# EasyEDA Pro project Flyback.eprj

# Schematic Schematic1
Board Name: Board1; Create Date: 2025-04-12
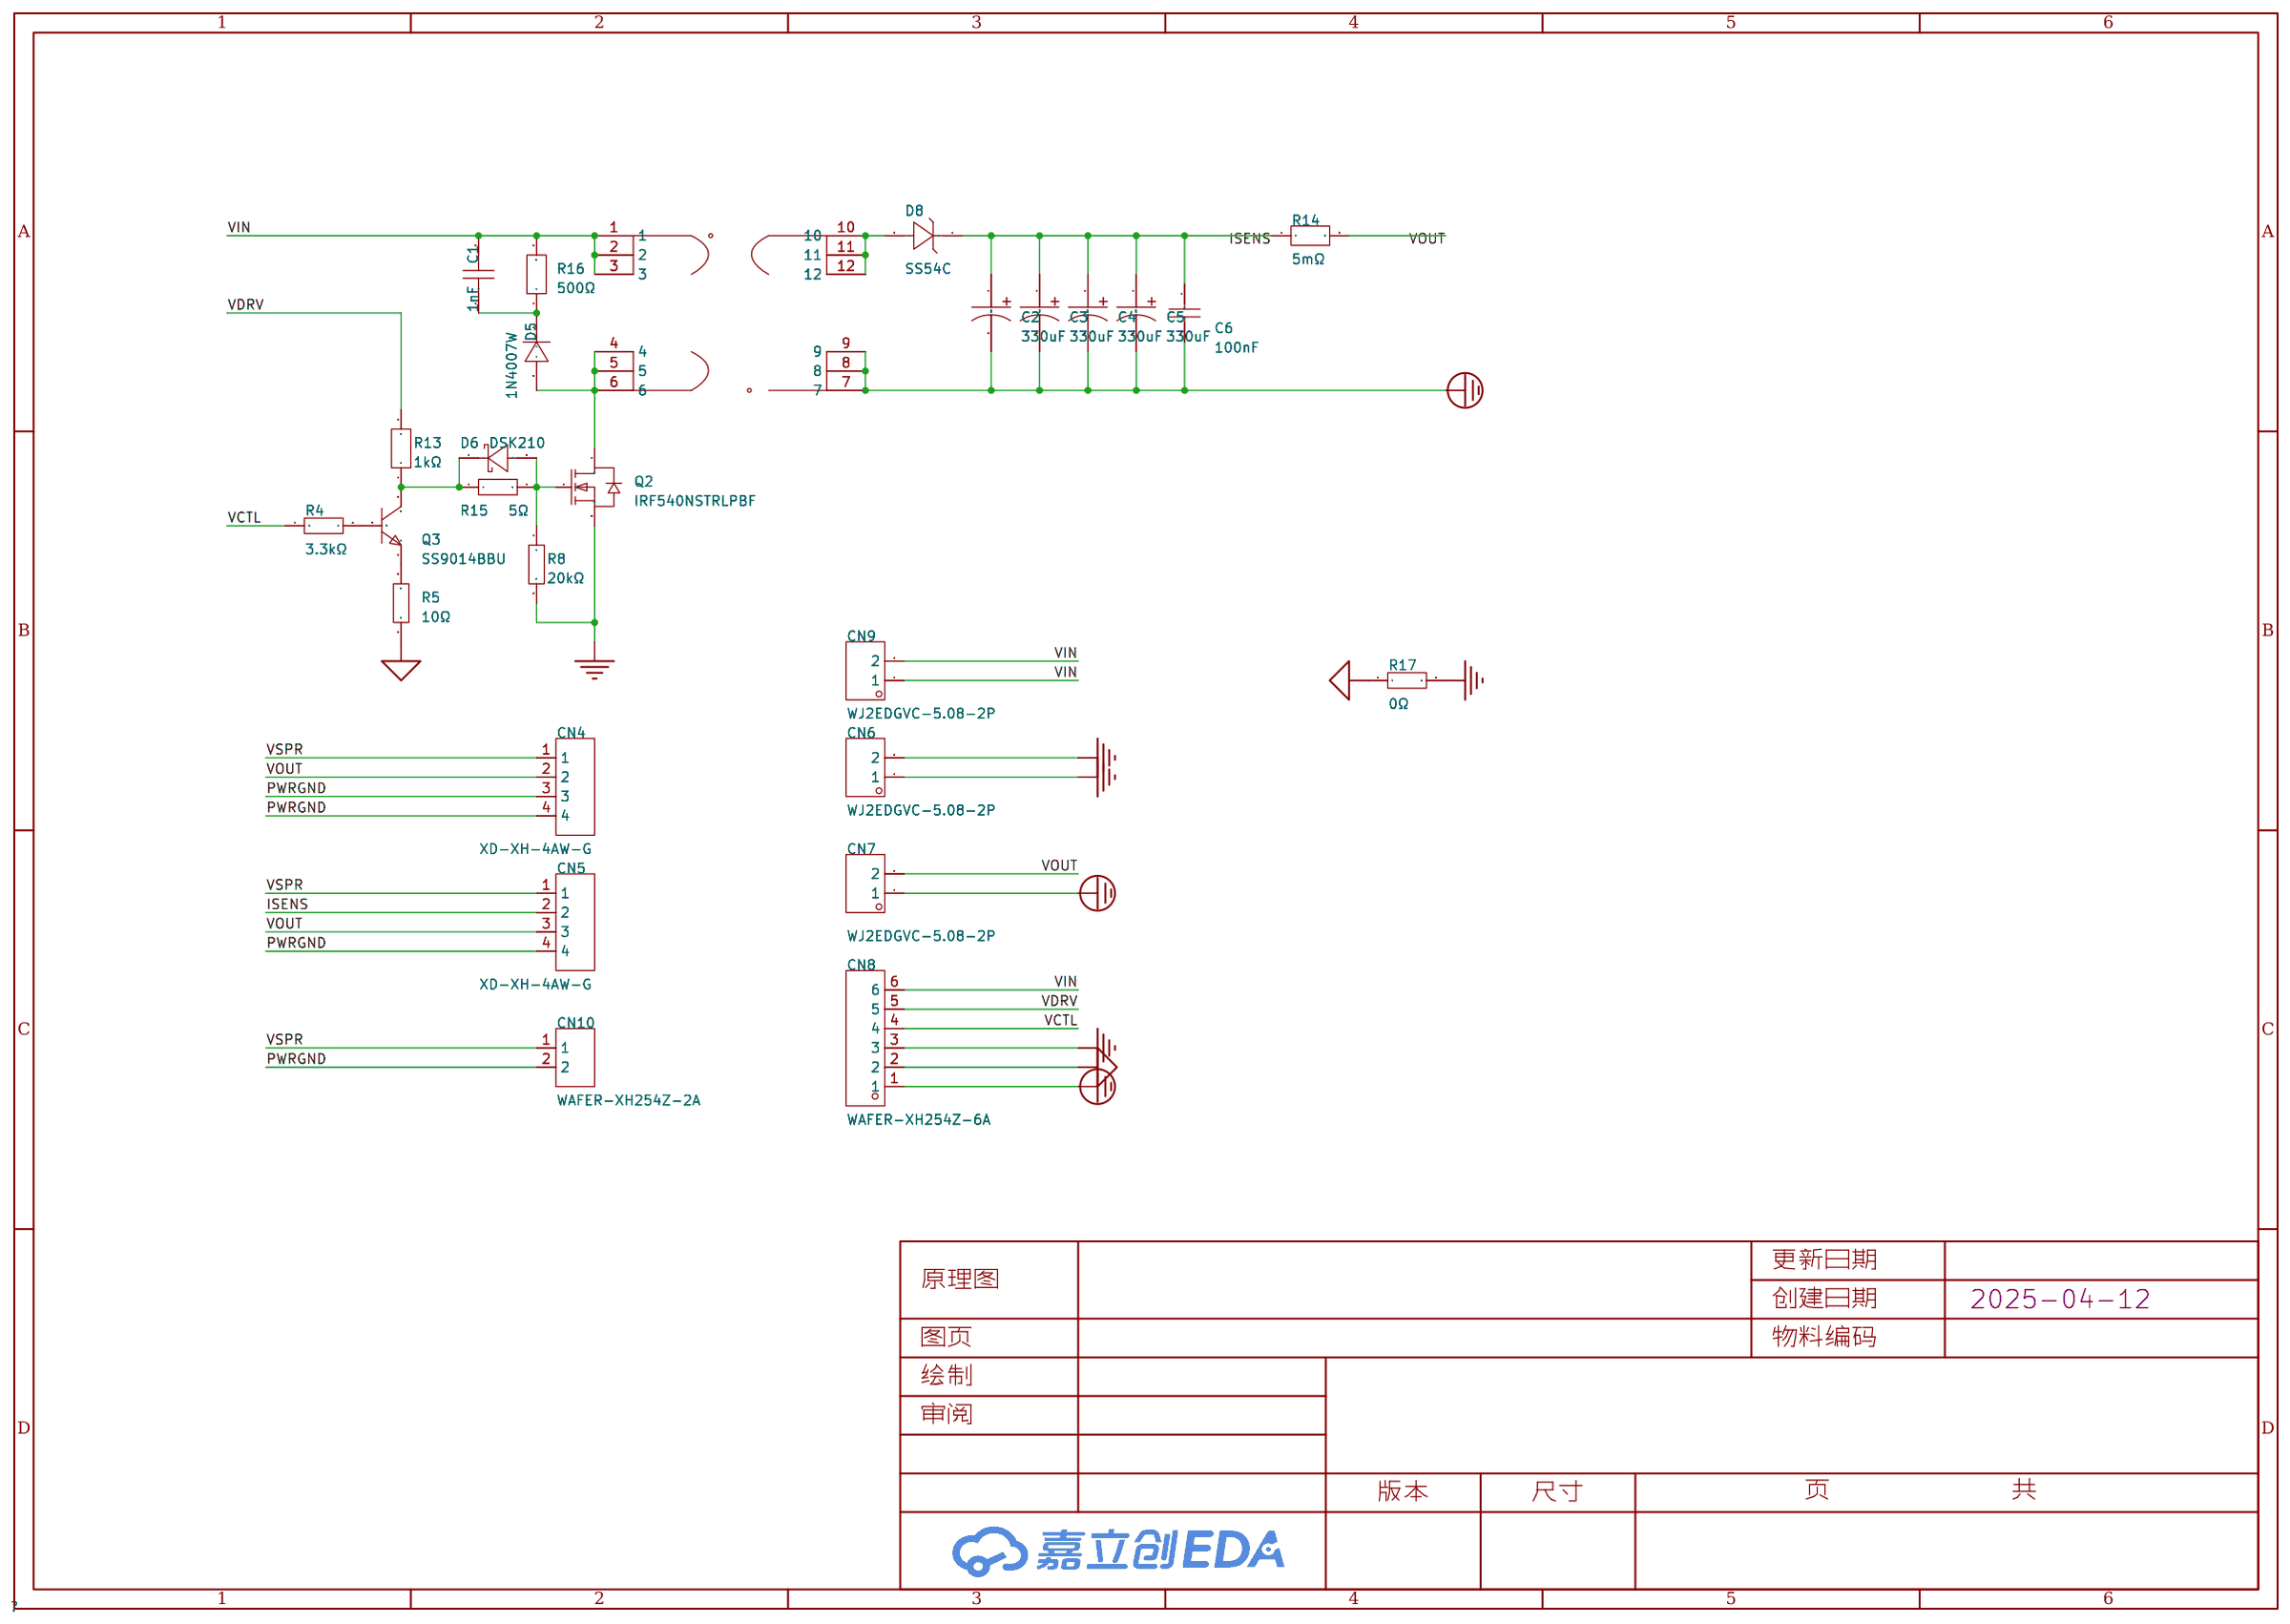
[diagram p0: schematic sheet]

## Parts
C1  1nF  [C0805]
C2  330uF  [CAP-TH_BD12.5-P5.00-D0.6-FD]
C3  330uF  [CAP-TH_BD12.5-P5.00-D0.6-FD]
C4  330uF  [CAP-TH_BD12.5-P5.00-D0.6-FD]
C5  330uF  [CAP-TH_BD12.5-P5.00-D0.6-FD]
C6  100nF  [C0805]
CN4  XD-XH-4AW-G  [CONN-TH_XD-XH-4AW-G]
CN5  XD-XH-4AW-G  [CONN-TH_XD-XH-4AW-G]
CN6  WJ2EDGVC-5.08-2P  [CONN-TH_WJ2EDGVC-5.08-2P]
CN7  WJ2EDGVC-5.08-2P  [CONN-TH_WJ2EDGVC-5.08-2P]
CN8  WAFER-XH254Z-6A  [CONN-TH_XH2.54-6P]
CN9  WJ2EDGVC-5.08-2P  [CONN-TH_WJ2EDGVC-5.08-2P]
CN10  WAFER-XH254Z-2A  [CONN-TH_2P-P2.50_XH-2A_3045048]
D5  1N4007W  [SOD-123FL_L2.7-W1.8-LS3.8-RD]
D6  DSK210  [SOD-123FL_L2.7-W1.8-LS3.8-RD]
D8  SS54C  [SMC_L6.9-W5.9-LS7.9-RD]
Q2  IRF540NSTRLPBF  [TO-263-2_L10.0-W9.1-P5.08-LS15.2-TL]
Q3  SS9014BBU  [TO-92-3_L4.8-W3.7-P1.27-L-1]
R4  3.3kΩ  [R0805]
R5  10Ω  [R1206]
R8  20kΩ  [R0805]
R13  1kΩ  [R0805]
R14  5mΩ  [RES-SMD_L6.4-W3.2-1]
R15  5Ω  [R0805_NEW]
R16  500Ω  [R0805]
R17  0Ω  [R0805]
T1  -  [PQ3220]

## Library data of the parts
C1 = CC0805KRX7R9BB102: LCSC Part Name: 1nF ±10% 50V; Supplier Part: C94121; Manufacturer: YAGEO(国巨); Supplier Footprint: 0805; JLCPCB Part Class: 扩展库; Datasheet: https://atta.szlcsc.com/upload/public/pdf/source/20170211/1486785656773.pdf; Supplier: LCSC; Tolerance: ±10%; Voltage Rated: 50V; Temperature Coefficient: X7R
C2-C5 = LKML1601K331MF: LCSC Part Name: 330uF ±20% 80V; Supplier Part: C443086; Manufacturer: Ymin(永铭); Supplier Footprint: 插件,D12.5xL16mm; JLCPCB Part Class: 扩展库; Datasheet: https://atta.szlcsc.com/upload/public/pdf/source/20200220/C487520_443A40905984A455D375EE990FEAA9E8.pdf; Supplier: LCSC; Tolerance: ±20%; Rated Voltage: 80V; Ripple Current: 1.368A@100kHz; Equivalent Series Resistance(ESR): 94mΩ@100kHz; Lead Spacing: 5mm; φD: 12.5mm; L: 16mm; Lifetime @ Temp: 10000hrs@105℃
C6 = CL21B104KCFNNNE: LCSC Part Name: 100nF ±10% 100V; Supplier Part: C28233; Manufacturer: SAMSUNG(三星); Supplier Footprint: 0805; JLCPCB Part Class: 基础库; Datasheet: https://atta.szlcsc.com/upload/public/pdf/source/20160218/1457707763339.pdf; Supplier: LCSC; Tolerance: ±10%; Voltage Rated: 100V; Temperature Coefficient: X7R
CN4 CN5 = XD-XH-4AW-G: 插针结构:1x4P;间距:2.54mm;安装方式:弯插;参考系列:XH;总PIN数:4P;排数:1;每排PIN数:4;行距:2.54mm;额定电流:3A;工作温度:-25℃~+85℃;; LCSC Part Name: 1x4P 间距:2.54mm 弯插 系列:XH; Supplier Part: C17700963; Manufacturer: XUNDA(讯答); Supplier Footprint: 插件,P=2.5mm; JLCPCB Part Class: 扩展库; Datasheet: https://atta.szlcsc.com/upload/public/pdf/source/20231019/EDD688933EF3B2A2948A0AD0307CAFB3.pdf; Supplier: LCSC; Pins Structure: 1x4P; Pitch: 2.54mm; Mounting Type: 弯插; Reference Series: XH; Number of Pins: 4P; Number of Rows: 1; Number of PINs Per Row: 4; Row Spacing: 2.54mm; Current Rating: 3A; Operating Temperature: -25℃~+85℃
CN6 CN7 CN9 = WJ2EDGVC-5.08-2P: LCSC Part Name: 1x2P 5.08mm 排数:1 每排P数:2; Supplier Part: C8445; Manufacturer: KANGNEX(康奈克斯电气); Supplier Footprint: 插件,P=5.08mm; JLCPCB Part Class: 扩展库; Datasheet: https://atta.szlcsc.com/upload/public/pdf/source/20191225/C8445_EB1D2D396D429FBA4C627FE17CC77AF0.pdf; Supplier: LCSC; Connector Type: 板端/插座-闭口; Structure: 1x2P; Pitch: 5.08mm; Color: 绿色; Mounting Style: 直针; Number of Pins: 2P; Number of Rows: 1; Number of PINs Per Row: 2; Current Rating (Max): 20A; Voltage Rating (Max): 450V; Contact Material: 黄铜; Contact Plating: 锡; Operating Temperature Range: -40℃~+105℃
CN8 = WAFER-XH254Z-6A: Supplier Part: C7432686; Manufacturer: HANBO(汉博); Supplier Footprint: 插件,P=2.5mm; JLCPCB Part Class: 扩展库; Datasheet: https://atta.szlcsc.com/upload/public/pdf/source/20230718/3B4FABA5D38EFB02DAF74E7C2B33D98F.pdf; Supplier: LCSC; Pins Structure: 1x6P; Pitch: 2.54mm; Mounting Style: 直插; Reference Series: XH; Number of Pins: 6P; Number of Rows: 1; Number of PINs Per Row: 6; Current Rating (Max): 3A; Operating Temperature Range: -25℃~+85℃
CN10 = WAFER-XH254Z-2A: Supplier Part: C7432682; Manufacturer: HANBO(汉博); Supplier Footprint: 插件,P=2.5mm; JLCPCB Part Class: 扩展库; Datasheet: https://atta.szlcsc.com/upload/public/pdf/source/20230718/3B4FABA5D38EFB02DAF74E7C2B33D98F.pdf; Supplier: LCSC; Pins Structure: 1x2P; Pitch: 2.54mm; Mounting Style: 直插; Reference Series: XH; Number of Pins: 2P; Number of Rows: 1; Number of PINs Per Row: 2; Current Rating (Max): 3A; Operating Temperature Range: -25℃~+85℃
D5 = 1N4007W_C18199088: 二极管配置:独立式;正向压降(Vf):1V@1.0A;直流反向耐压(Vr):1kV;整流电流:1A;; Supplier Part: C18199088; Manufacturer: 宏迦橙; Supplier Footprint: SOD-123FL; JLCPCB Part Class: 扩展库; Datasheet: https://atta.szlcsc.com/upload/public/pdf/source/20230925/B0AB2B510D392D7083D021E804ED238F.pdf; Supplier: LCSC; Diode Configuration: 独立式; Forward Voltage (Vf@If): 1V@1.0A; Reverse Voltage (Vr): 1kV; Rectified Current: 1A; Reverse Leakage Current (Ir): 2uA@1000V
D6 = DSK210_C7502713: 二极管配置:独立式;正向压降(Vf):850mV@2A;直流反向耐压(Vr):100V;整流电流:2A;; LCSC Part Name: 电压:100V 电流:2A; Supplier Part: C7502713; Manufacturer: 宏迦橙; Supplier Footprint: SOD-123FL; JLCPCB Part Class: 扩展库; Datasheet: https://atta.szlcsc.com/upload/public/pdf/source/20240814/18366EFEA8C1355349286254791BE851.pdf; Supplier: LCSC; Diode Configuration: 独立式; Forward Voltage (Vf@If): 850mV@2A; Reverse Voltage (Vr): 100V; Rectified Current: 2A; Reverse Leakage Current (Ir): 500uA
D8 = SS54C_C18199188: LCSC Part Name: 电压:40V 电流:5A; Supplier Part: C18199188; Manufacturer: 宏嘉诚; Supplier Footprint: SMC; JLCPCB Part Class: Extended Part; Datasheet: https://atta.szlcsc.com/upload/public/pdf/source/20250121/C8C02882BF646CD53749048C4D8B1479.pdf; Supplier: LCSC; Diode Configuration: 独立式; Voltage - DC Reverse(Vr): 40V; Current - Rectified: 5A; Reverse Leakage Current (Ir): 150uA@40V
Q2 = IRF540NSTRLPBF: 类型:1个N沟道;漏源电压(Vdss):100V;连续漏极电流(Id):33A;导通电阻(RDS(on)@Vgs,Id):44mΩ@10V,16A;功率(Pd):130W;阈值电压(Vgs(th)@Id):2V@250uA;; LCSC Part Name: 1个N沟道 耐压:100V 电流:33A; Supplier Part: C23982; Manufacturer: Infineon(英飞凌); Supplier Footprint: D2PAK; JLCPCB Part Class: 扩展库; Datasheet: https://atta.szlcsc.com/upload/public/pdf/source/20140304/1457707006167.pdf; Supplier: LCSC; Type: 1个N沟道; Drain Source Voltage (Vdss): 100V; Continuous Drain Current (Id): 33A; Drain Source On Resistance (RDS(on)@Vgs,Id): 44mΩ@10V,16A; Power Dissipation (Pd): 130W; Gate Threshold Voltage (Vgs(th)@Id): 2V@250uA; Total Gate Charge (Qg@Vgs): 71nC; Input Capacitance (Ciss@Vds): 1.96nF; Reverse Transfer Capacitance (Crss@Vds): 40pF; Operating Temperature: -55℃~+175℃
Q3 = SS9014BBU: 晶体管类型:NPN;集电极电流(Ic):100mA;集射极击穿电压(Vceo):45V;耗散功率(Pd):450mW;直流电流增益(hFE):100@1mA,5V;; Supplier Part: C3201679; Manufacturer: onsemi(安森美); Supplier Footprint: TO-92-3; JLCPCB Part Class: 扩展库; Datasheet: https://atta.szlcsc.com/upload/public/pdf/source/20230915/876D150E45002D61DA6E9B0FBE5B5A11.pdf; Supplier: LCSC; type: NPN; Current - Collector(Ic): 100mA; Collector - Emitter Voltage VCEO: 45V; Pd - Power Dissipation(Pd): 450mW; DC Current Gain (hFE@Ic,Vce): 100@1mA,5V; Transition frequency(fT): 270MHz; Current - Collector Cutoff: 50nA; Collector-Emitter Saturation Voltage (VCE(sat)@Ic,Ib): 300mV@100mA,5mA
R4 = 0805W8F3301T5E: 电阻类型:厚膜电阻;阻值:3.3kΩ;精度:±1%;功率:125mW;最大工作电压:150V;温度系数:±100ppm/℃;; LCSC Part Name: 3.3kΩ ±1% 125mW 厚膜电阻; Supplier Part: C26010; Manufacturer: UNI-ROYAL(厚声); Supplier Footprint: 0805; JLCPCB Part Class: 基础库; Datasheet: https://atta.szlcsc.com/upload/public/pdf/source/20200306/C422600_1E6D84923E4A46A82E41ADD87F860B5C.pdf; Supplier: LCSC; Type: 厚膜电阻; Tolerance: ±1%; Power(Watts): 125mW; Overload Voltage (Max): 150V; Temperature Coefficient: ±100ppm/℃; Operating Temperature Range: -55℃~+155℃
R5 = 1206W4F100JT5E: 电阻类型:厚膜电阻;阻值:10Ω;精度:±1%;功率:250mW;最大工作电压:200V;温度系数:±400ppm/℃;; LCSC Part Name: 10Ω ±1% 250mW 厚膜电阻; Supplier Part: C17903; Manufacturer: UNI-ROYAL(厚声); Supplier Footprint: 1206; JLCPCB Part Class: 基础库; Datasheet: https://atta.szlcsc.com/upload/public/pdf/source/20200306/C422600_1E6D84923E4A46A82E41ADD87F860B5C.pdf; Supplier: LCSC; Type: 厚膜电阻; Tolerance: ±1%; Power(Watts): 250mW; Overload Voltage (Max): 200V; Temperature Coefficient: ±400ppm/℃; Operating Temperature Range: -55℃~+155℃
R8 = 0805W8F2002T5E: 电阻类型:厚膜电阻;阻值:20kΩ;精度:±1%;功率:125mW;最大工作电压:150V;温度系数:±100ppm/℃;; LCSC Part Name: 20kΩ ±1% 125mW 厚膜电阻; Supplier Part: C4328; Manufacturer: UNI-ROYAL(厚声); Supplier Footprint: 0805; JLCPCB Part Class: 基础库; Datasheet: https://atta.szlcsc.com/upload/public/pdf/source/20200306/C422600_1E6D84923E4A46A82E41ADD87F860B5C.pdf; Supplier: LCSC; Type: 厚膜电阻; Tolerance: ±1%; Power(Watts): 125mW; Overload Voltage (Max): 150V; Temperature Coefficient: ±100ppm/℃; Operating Temperature Range: -55℃~+155℃
R13 = Y16241K00000T24R: 电阻类型:-;阻值:1kΩ;精度:±0.01%;功率:200mW;温度系数:±0.2ppm/℃;; LCSC Part Name: 1kΩ ±0.01% 200mW; Supplier Part: C4147541; Manufacturer: VISHAY(威世); Supplier Footprint: 0805; JLCPCB Part Class: 扩展库; Supplier: LCSC; Tolerance: ±0.01%; Power(Watts): 200mW; Temperature Coefficient: ±0.2ppm/℃; Operating Temperature: -55℃~+150℃
R14 = HoJLR2512-3W-5mR-1%: 电阻类型:采样电阻;阻值:5mΩ;精度:±1%;功率:3W;安装方式:贴片;; LCSC Part Name: 5mΩ ±1% 3W; Supplier Part: C2903482; Manufacturer: Milliohm(毫欧); Supplier Footprint: 2512; JLCPCB Part Class: 扩展库; Datasheet: https://atta.szlcsc.com/upload/public/pdf/source/20211009/7525CABAB363C979E942C1DD41F1FEF0.pdf; Supplier: LCSC; Type: 采样电阻; Tolerance: ±1%; Power(Watts): 3W; Mounting Sytle: 贴片
R15 = 0805W8F100JT5E: 电阻类型:厚膜电阻;阻值:10Ω;精度:±1%;功率:125mW;最大工作电压:150V;温度系数:±200ppm/℃;; LCSC Part Name: 10Ω ±1% 125mW 厚膜电阻; Supplier Part: C17415; Manufacturer: UNI-ROYAL(厚声); Supplier Footprint: 0805; JLCPCB Part Class: 基础库; Datasheet: https://atta.szlcsc.com/upload/public/pdf/source/20200306/C422600_1E6D84923E4A46A82E41ADD87F860B5C.pdf; Supplier: LCSC; Type: 厚膜电阻; Tolerance: ±1%; Power(Watts): 125mW; Overload Voltage (Max): 150V; Temperature Coefficient: ±200ppm/℃; Operating Temperature Range: -55℃~+155℃
R16 = ARG05FTC5000: LCSC Part Name: 薄膜电阻 500Ω ±1% 125mW; Supplier Part: C2828857; Manufacturer: Viking(光颉); Supplier Footprint: 0805; JLCPCB Part Class: 扩展库; Datasheet: https://atta.szlcsc.com/upload/public/pdf/source/20210426/C2828737_35D2DDB0BDDA00747C2712435E28BBD4.pdf; Supplier: LCSC; Type: 薄膜电阻; Tolerance: ±1%; Power(Watts): 125mW; Overload Voltage (Max): 150V; Temperature Coefficient: ±25ppm/℃; Operating Temperature Range: -55℃~+155℃
R17 = 0805W8F0000T5E: LCSC Part Name: 0Ω ±1% 125mW 厚膜电阻; Supplier Part: C17477; Manufacturer: UNI-ROYAL(厚声); Supplier Footprint: 0805; JLCPCB Part Class: 基础库; Datasheet: https://atta.szlcsc.com/upload/public/pdf/source/20200306/C422600_1E6D84923E4A46A82E41ADD87F860B5C.pdf; Supplier: LCSC; Type: 厚膜电阻; Tolerance: ±1%; Power(Watts): 125mW; Overload Voltage (Max): 150V; Temperature Coefficient: ±800ppm/℃; Operating Temperature Range: -55℃~+155℃
T1 = Flyback19:3

## Nets
AGND: CN8.2 R5.1 R17.1
GND: CN6.1 CN6.2 CN8.3 Q2.3(S) R8.2 R17.2
VIN: C1.2 CN8.6 CN9.1 CN9.2 R16.2 T1.1 T1.2 T1.3
ISENS: C2.1 C3.1 C4.1 C5.1 C6.1 CN5.2 D8.1(K) R14.1
PWRGND: C2.2 C3.2 C4.2 C5.2 C6.2 CN4.3 CN4.4 CN5.4 CN7.1 CN8.1 CN10.2 T1.7 T1.8 T1.9
VCTL: CN8.4 R4.1
VDRV: CN8.5 R13.2
VOUT: CN4.2 CN5.3 CN7.2 R14.2
VSPR: CN4.1 CN5.1 CN10.1
$1N215: Q3.1(E) R5.2
$1N217: D6.1(K) Q3.3(C) R13.1 R15.1
$1N219: Q3.2(B) R4.2
$1N312: D6.2(A) Q2.1(G) R8.1 R15.2
$1N954: D5.2(A) Q2.4(D) T1.4 T1.5 T1.6
$1N1101: C1.1 D5.1(K) R16.1
$1N4450: D8.2(A) T1.10 T1.11 T1.12

# Board PCB1
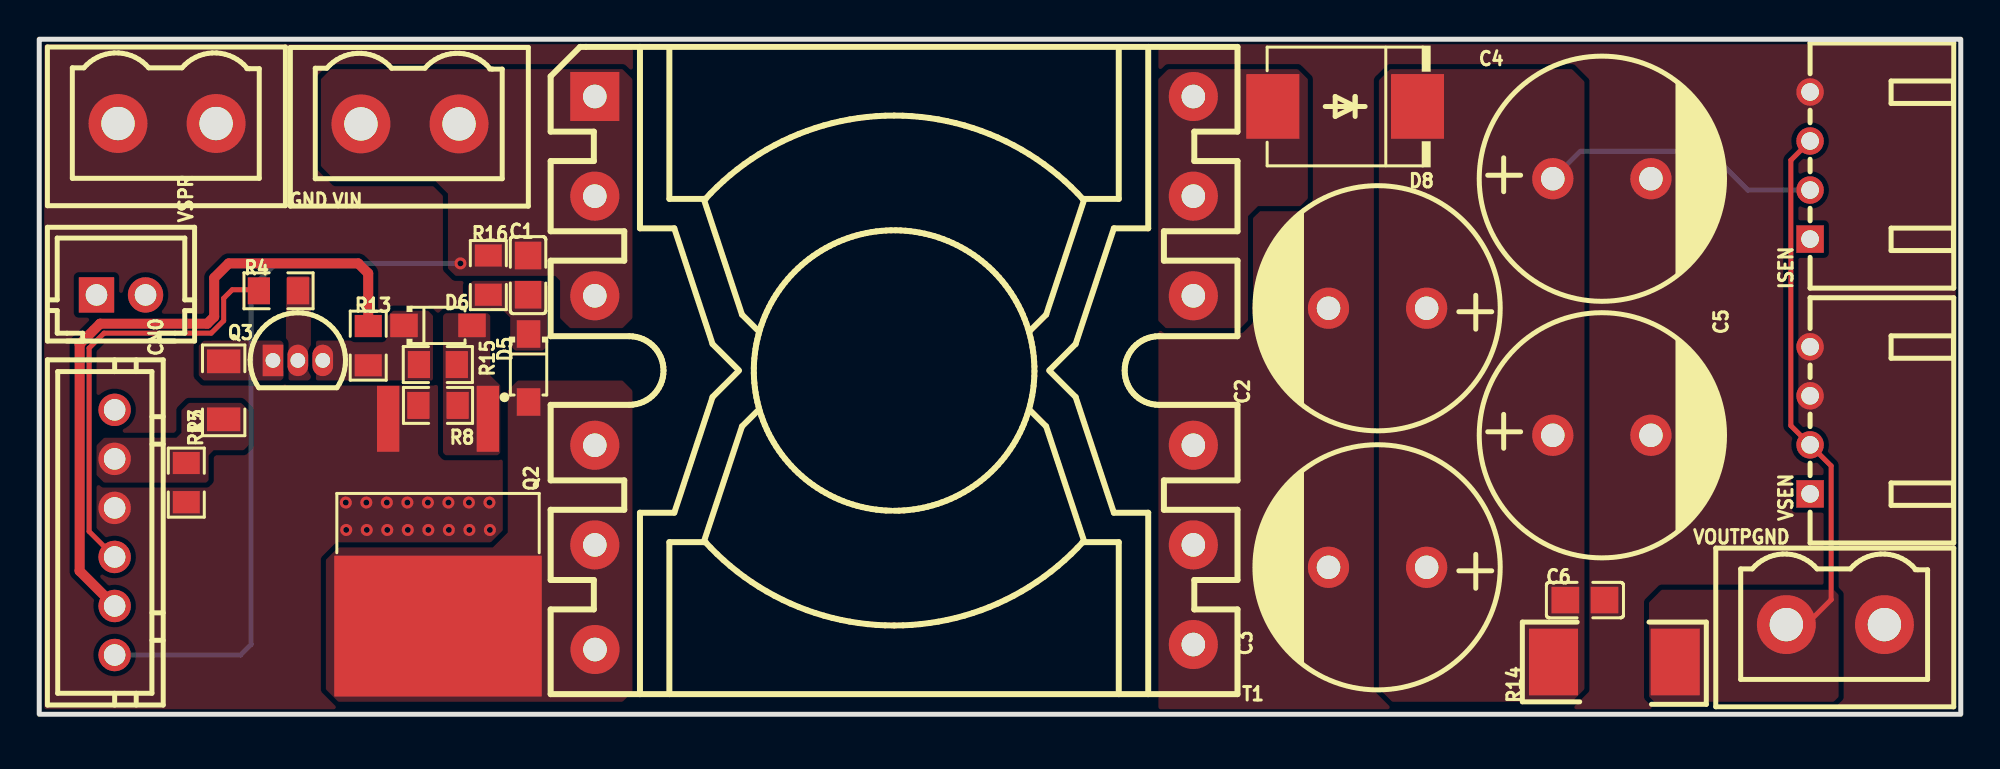
[diagram p1: board, top side]
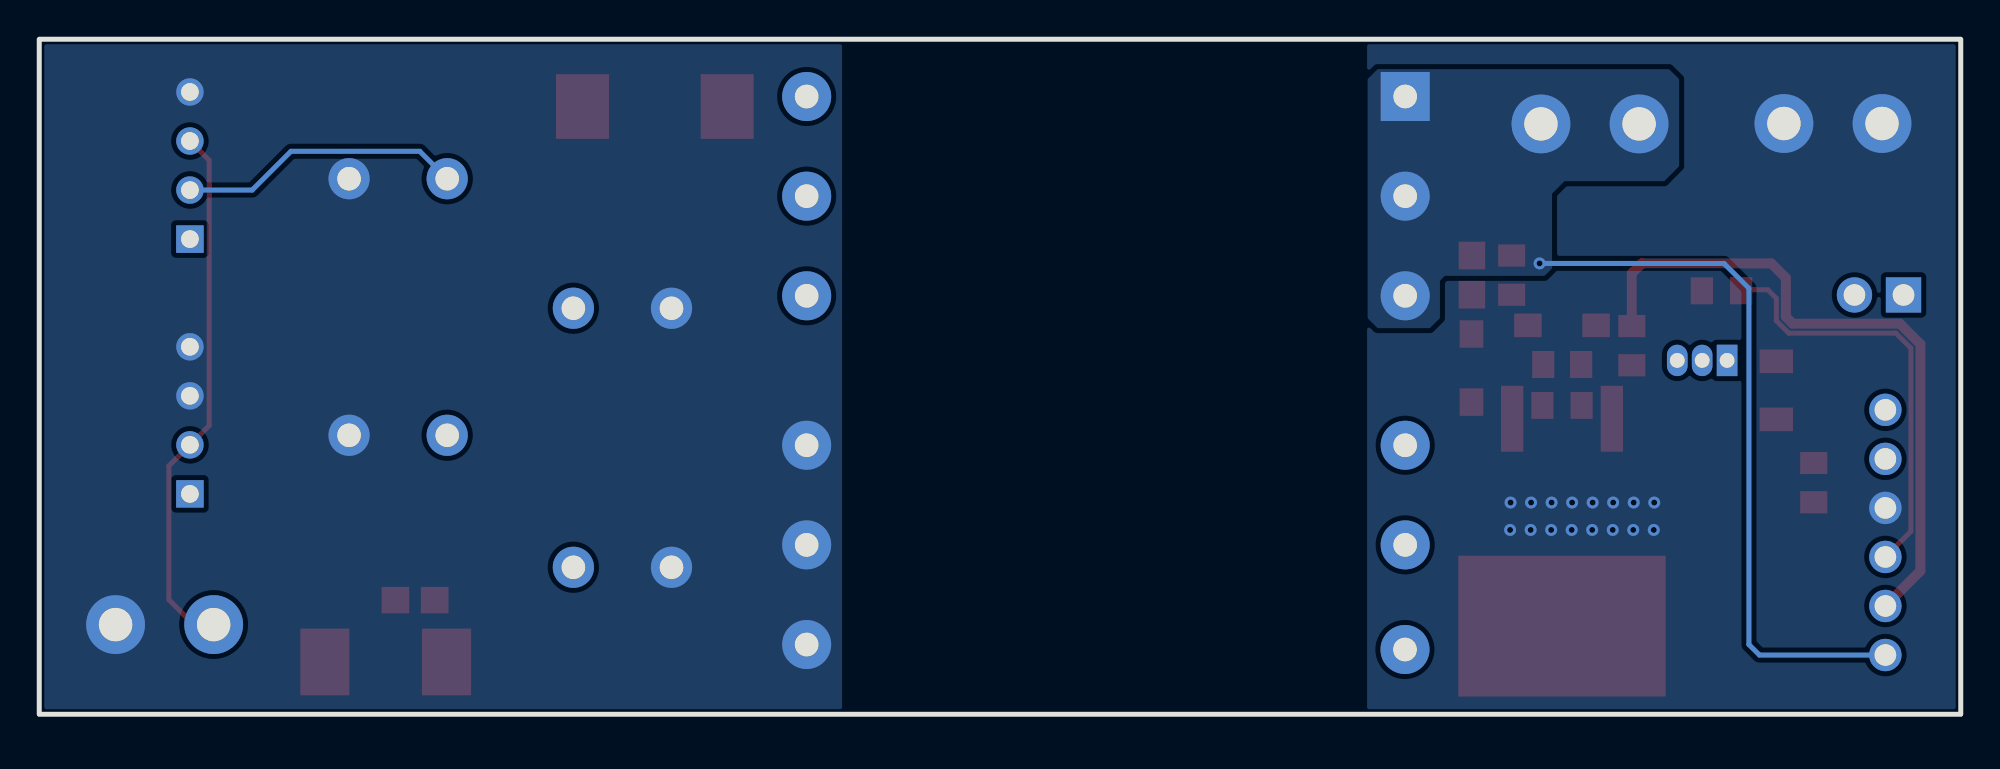
[diagram p2: board, bottom side, seen from below]

Outline 97.92 x 34.42 mm; copper layers: Top Layer, Inner1, Inner2, Bottom Layer. Coordinates in mm from the lower left corner of the outline.
Outline path: rectangle 0,34.42 97.92,0
Stack: Top Layer 0.035mm 外层铜厚1oz / Dielectric1 0.2104mm 7628 RC49% 8.6mil / Inner1 0.0152mm 内层铜厚 / Dielectric2 1.065mm 1.1mm H/HOZ Copper / Inner2 0.0152mm 内层铜厚 / Dielectric3 0.2104mm 7628 RC49% 8.6mil / Bottom Layer 0.035mm 外层铜厚1oz

## Design rules (mm)
template: 自定义配置
spacing copperThickness1oz (default): track to track 0.102, other pairs 0.152 to 0.3
spacing copperThickness2oz: track to track 0.203, other pairs 0.152 to 0.3
track width copperThickness1oz (default): min 0.127, default 0.254, max 2.54
track width copperThickness2oz: min 0.203, default 0.254, max 2.54
differential pair differentialPair (default): width min 0.127, default 0.254, max 2.54; gap min 0.152, default 0.152
via viaSize (default): diameter min 0.5, default 0.61, max 10; hole min 0.3, default 0.305, max 6.3
net VIN uses copperRegion1
net $1N1101 uses copperRegion1
net VOUT uses copperRegion1
net $1N954 uses copperRegion1
net $1N312 uses copperRegion1
net $1N217 uses copperRegion1
net GND uses copperRegion1
net $1N219 uses copperRegion1
net $1N215 uses copperRegion1
net AGND uses copperRegion1
net PWRGND uses copperRegion1
net ISENS uses copperRegion1
net $1N4450 uses copperRegion1

## Placement (name value [footprint] x y rotation side)
C1  1nF  [C0805]  24.91 22.39 90 top
C2  330uF  [CAP-TH_BD12.5-P5.00-D0.6-FD]  68.2 20.7 180 top
C3  330uF  [CAP-TH_BD12.5-P5.00-D0.6-FD]  68.2 7.49 180 top
C4  330uF  [CAP-TH_BD12.5-P5.00-D0.6-FD]  79.63 27.3 0 top
C5  330uF  [CAP-TH_BD12.5-P5.00-D0.6-FD]  79.63 14.22 0 top
C6  100nF  [C0805]  78.77 5.82 0 top
CN0  WAFER-XH254Z-6A  [CONN-TH_XH2.54-6P]  3.84 9.27 270 top
D5  1N4007W  [SOD-123FL_L2.7-W1.8-LS3.8-RD]  24.93 17.65 270 top
D6  DSK210  [SOD-123FL_L2.7-W1.8-LS3.8-RD]  20.32 19.83 0 top
D8  SS54C  [SMC_L6.9-W5.9-LS7.9-RD]  66.55 30.99 180 top
GND  WJ2EDGVC-5.08-2P  [CONN-TH_WJ2EDGVC-5.08-2P]  6.51 30.12 180 top
ISEN  XD-XH-4AW-G  [CONN-TH_XD-XH-4AW-G]  90.24 27.98 90 top
Q2  IRF540NSTRLPBF  [TO-263-2_L10.0-W9.1-P5.08-LS15.2-TL]  20.32 9.78 270 top
Q3  SS9014BBU  [TO-92-3_L4.8-W3.7-P1.27-L-1]  13.18 18.04 0 top
R4  3.3kΩ  [R0805]  12.19 21.59 0 top
R5  10Ω  [R1206]  9.4 16.52 90 top
R8  20kΩ  [R0805]  20.32 15.75 180 top
R13  1kΩ  [R0805]  16.76 18.79 90 top
R14  5mΩ  [RES-SMD_L6.4-W3.2-1]  80.26 2.67 0 top
R15  5Ω  [R0805_NEW]  20.31 17.83 0 top
R16  500Ω  [R0805]  22.88 22.39 90 top
R17  0Ω  [R0805]  7.49 11.81 270 top
T1  -  [PQ3220]  43.56 17.53 270 top
VIN  WJ2EDGVC-5.08-2P  [CONN-TH_WJ2EDGVC-5.08-2P]  18.89 30.1 180 top
VOUTPGND  WJ2EDGVC-5.08-2P  [CONN-TH_WJ2EDGVC-5.08-2P]  91.53 4.57 180 top
VSEN  XD-XH-4AW-G  [CONN-TH_XD-XH-4AW-G]  90.24 14.99 90 top
VSPR  WAFER-XH254Z-2A  [CONN-TH_2P-P2.50_XH-2A_3045048]  4.17 21.38 0 top

## Footprints (pads in the part's own frame, mm; a bottom-side part is the same pattern mirrored in y, then rotated)
C0805
  rect 1.41x1.35 smd: 1(-1,0) 2(1,0)
CAP-TH_BD12.5-P5.00-D0.6-FD
  round 2.1 hole 1.2: 1(-2.5,0) 2(2.5,0)
CONN-TH_2P-P2.50_XH-2A_3045048
  rect 1.8x1.8 hole 1.1: 1(-1.25,0)
  round 1.8 hole 1.1: 2(1.25,0)
CONN-TH_WJ2EDGVC-5.08-2P
  round 3 hole 1.7: 1(-2.499,0) 2(2.499,0)
CONN-TH_XD-XH-4AW-G
  rect 1.4x1.4 hole 0.9: 1(-3.75,0)
  round 1.4 hole 0.9: 2(-1.25,0) 3(1.25,0) 4(3.75,0)
CONN-TH_XH2.54-6P
  round 1.65 hole 1.1: 1(-6.25,0) 2(-3.75,0) 3(-1.25,0) 4(1.25,0) 5(3.75,0) 6(6.25,0)
PQ3220
  rect 2.5x2.5 hole 1.205x1.2: 1(-13.972,-15.252)
  round 2.5 hole 1.205x1.2: 2(-8.89,-15.25) 3(-3.81,-15.25) 4(3.81,-15.25) 5(8.89,-15.25) 6(14.224,-15.24) 7(13.97,15.25) 8(8.89,15.25) 9(3.81,15.25) 10(-3.81,15.25) 11(-8.89,15.25) 12(-13.97,15.25)
R0805
  rect 1.133x1.377 smd: 1(-1,0) 2(1,0)
R0805_NEW
  rect 1.133x1.377 smd: 1(-0.966,0) 2(0.966,0)
R1206
  rect 1.208x1.701 smd: 1(-1.479,0) 2(1.479,0)
RES-SMD_L6.4-W3.2-1
  rect 2.5x3.4 smd: 1(-3.1,0) 2(3.1,0)
SMC_L6.9-W5.9-LS7.9-RD
  rect 2.7x3.3 smd: 1(-3.687,0) 2(3.687,0)
SOD-123FL_L2.7-W1.8-LS3.8-RD
  rect 1.4x1.2 smd: 1(-1.735,0) 2(1.735,0)
TO-92-3_L4.8-W3.7-P1.27-L-1
  rect 1.05x1.6 hole 0.75: 1(-1.27,0)
  oval 1.05x1.6 hole 0.75: 2(0,0) 3(1.27,0)
TO-263-2_L10.0-W9.1-P5.08-LS15.2-TL
  rect 3.358x1.134 smd: 1(-5.286,2.54) 3(-5.286,-2.54)
  rect 7.181x10.566 smd: 4(5.286,0)

## Nets
AGND: CN0.2 R5.1 R17.1
GND: CN0.3 GND.1 GND.2 Q2.3 R8.2 R17.2
VIN: C1.2 CN0.6 R16.2 T1.1 T1.2 T1.3 VIN.1 VIN.2
ISENS: C2.1 C3.1 C4.1 C5.1 C6.1 D8.1 ISEN.2 R14.1
PWRGND: C2.2 C3.2 C4.2 C5.2 C6.2 CN0.1 ISEN.4 T1.7 T1.8 T1.9 VOUTPGND.1 VSEN.3 VSEN.4 VSPR.2
VCTL: CN0.4 R4.1
VDRV: CN0.5 R13.2
VOUT: ISEN.3 R14.2 VOUTPGND.2 VSEN.2
VSPR: ISEN.1 VSEN.1 VSPR.1
$1N215: Q3.1 R5.2
$1N217: D6.1 Q3.3 R13.1 R15.1
$1N219: Q3.2 R4.2
$1N312: D6.2 Q2.1 R8.1 R15.2
$1N954: D5.2 Q2.4 T1.4 T1.5 T1.6
$1N1101: C1.1 D5.1 R16.1
$1N4450: D8.2 T1.10 T1.11 T1.12

## Via types
v1: diameter 0.61, hole 0.305, Top Layer to Bottom Layer, 17 vias

## Routing (per net, layer and track width the routed paths; a pad name or vN(x,y) marks a point on that pad's centre or on a via; arc(x,y) is an arc through that point)
GND:
  vias: v1(15.62,10.8) v1(15.64,9.4) v1(16.67,10.8) v1(16.69,9.4) v1(17.71,10.8) v1(17.73,9.4) v1(18.76,10.8) v1(18.78,9.4) v1(19.8,10.8) v1(19.83,9.4) v1(20.85,10.8) v1(20.87,9.4) v1(21.9,10.8) v1(21.92,9.4) v1(22.94,10.8) v1(22.96,9.4)
VIN: length 36.5
  Bottom Layer w0.254: v1(21.46,22.99) 12.06,22.99 10.8,21.72 10.8,3.56 10.26,3.02 CN0.6
ISENS: length 14.5
  Bottom Layer w0.254: ISEN.2 87.06,26.73 85.09,28.7 78.53,28.7 C4.1
PWRGND: length 126.2
  Inner1 w0.508: VSEN.3 88.67,16.24 87.78,17.12 87.78,32.77 87.3,33.25 1.52,33.25 1.16,32.89 1.16,23.99 2.47,22.69 4.11,22.69 VSPR.2 5.42,19.13 3.84,17.56 CN0.1
VCTL: length 21.8
  Top Layer w0.254: R4.1 11.14,21.64 9.83,21.64 9.4,21.21 9.4,20.07 8.76,19.43 3.3,19.43 2.54,18.67 2.54,9.32 CN0.4
VDRV: length 34.6
  Top Layer w0.508: CN0.5 2.06,7.31 2.06,18.87 3.1,19.91 8.56,19.91 8.92,20.27 8.92,22.25 9.65,22.99 16.26,22.99 16.76,22.48 R13.2
VOUT: length 27.5
  Top Layer w0.254: ISEN.3 89.26,28.25 89.26,14.72 VSEN.2 91.31,12.66 91.31,5.84 90.04,4.57 VOUTPGND.2
VSPR: length 127.7
  Inner1 w0.508: VSPR.1 0.55,23.74 0.55,33.57 0.84,33.86 87.68,33.86 88.39,33.15 88.39,24.64 88.8,24.23 ISEN.1 91.47,24.23 91.82,23.88 91.82,11.56 91.5,11.24 VSEN.1

## Copper pours and planes (outline as drawn; the poured copper is in the pictures)
AGND on Top Layer: 2.79,13.59 3.3,14.1 6.98,14.1 7.24,14.35 7.24,15.49 7.62,15.88 10.29,15.88 10.67,15.49 10.67,13.72 10.41,13.46 8.89,13.46 8.64,13.21 8.64,11.94 8.51,11.81 3.3,11.81 2.79,12.32
GND on Top Layer: 0,34.42 30.25,34.42 30.25,0 0,0
GND on Bottom Layer: 0,34.42 30.26,34.42 30.26,0 0,0
GND on Inner2: 0,34.42 30.24,34.42 30.24,0 0,0
VIN on Top Layer: 14.35,32.38 14.86,32.89 29.72,32.89 30.23,32.38 30.23,20.19 29.72,19.69 27.05,19.69 26.54,20.19 26.54,22.1 26.29,22.35 21.21,22.35 20.83,22.73 20.83,26.54 20.19,27.18 15.11,27.18 14.35,27.94
VIN on Bottom Layer: 14.35,32.38 14.86,32.89 29.72,32.89 30.23,32.38 30.23,20.19 29.72,19.69 27.05,19.69 26.54,20.19 26.54,22.1 26.29,22.35 21.21,22.35 20.83,22.73 20.83,26.54 20.19,27.18 15.11,27.18 14.35,27.94
ISENS on Top Layer: 68.83,32.89 78.11,32.89 78.74,32.26 78.74,1.28 78.1,0.63 68.94,0.63 68.27,1.31 68.27,32.33
PWRGND on Top Layer: 57.03,34.42 97.92,34.42 97.92,0 57.03,0
PWRGND on Bottom Layer: 97.92,34.42 97.92,0 57.01,0 57.01,34.42
PWRGND on Inner2: 57.02,34.42 97.92,34.42 97.92,0 57.15,0 57.02,-0.13
VOUT on Top Layer: 82.03,5.7 82.68,6.35 91.44,6.35 91.69,6.1 91.69,0.89 91.44,0.63 82.3,0.63 82.03,0.9
$1N215 on Top Layer: 8.13,18.8 8.38,19.05 12.32,19.05 12.45,18.92 12.45,17.14 12.32,17.02 8.38,17.02 8.13,17.27
$1N217 on Top Layer: 13.97,19.05 17.53,19.05 17.78,19.3 17.78,20.32 18.03,20.57 19.81,20.57 20.07,20.32 20.07,17.02 13.97,17.02 13.84,17.14 13.84,18.92
$1N219 on Top Layer: 12.57,22.22 12.7,22.35 13.72,22.35 13.84,22.22 13.84,17.14 13.72,17.02 12.7,17.02 12.57,17.14
$1N312 on Top Layer: 20.57,20.32 20.7,20.45 22.86,20.45 22.99,20.32 22.99,17.27 23.5,16.76 23.5,13.33 23.37,13.21 20.7,13.21 20.57,13.33
$1N954 on Top Layer: 14.61,7.87 15.24,8.51 23.11,8.51 23.88,9.27 23.88,16.51 24.38,17.02 29.72,17.02 30.23,16.51 30.23,1.14 29.72,0.63 15.24,0.63 14.61,1.27
$1N1101 on Top Layer: 21.84,21.84 22.1,22.1 25.68,22.1 25.89,21.88 25.89,18.78 25.65,18.54 24.26,18.54 24,18.8 24,20.22 23.6,20.63 22.04,20.63 21.84,20.83
$1N4450 on Top Layer: 57.02,32.38 57.53,32.89 64.14,32.89 64.64,32.38 64.64,26.29 64.26,25.91 62.1,25.91 61.6,25.4 61.6,20.07 61.21,19.69 57.4,19.69 57.02,20.07
